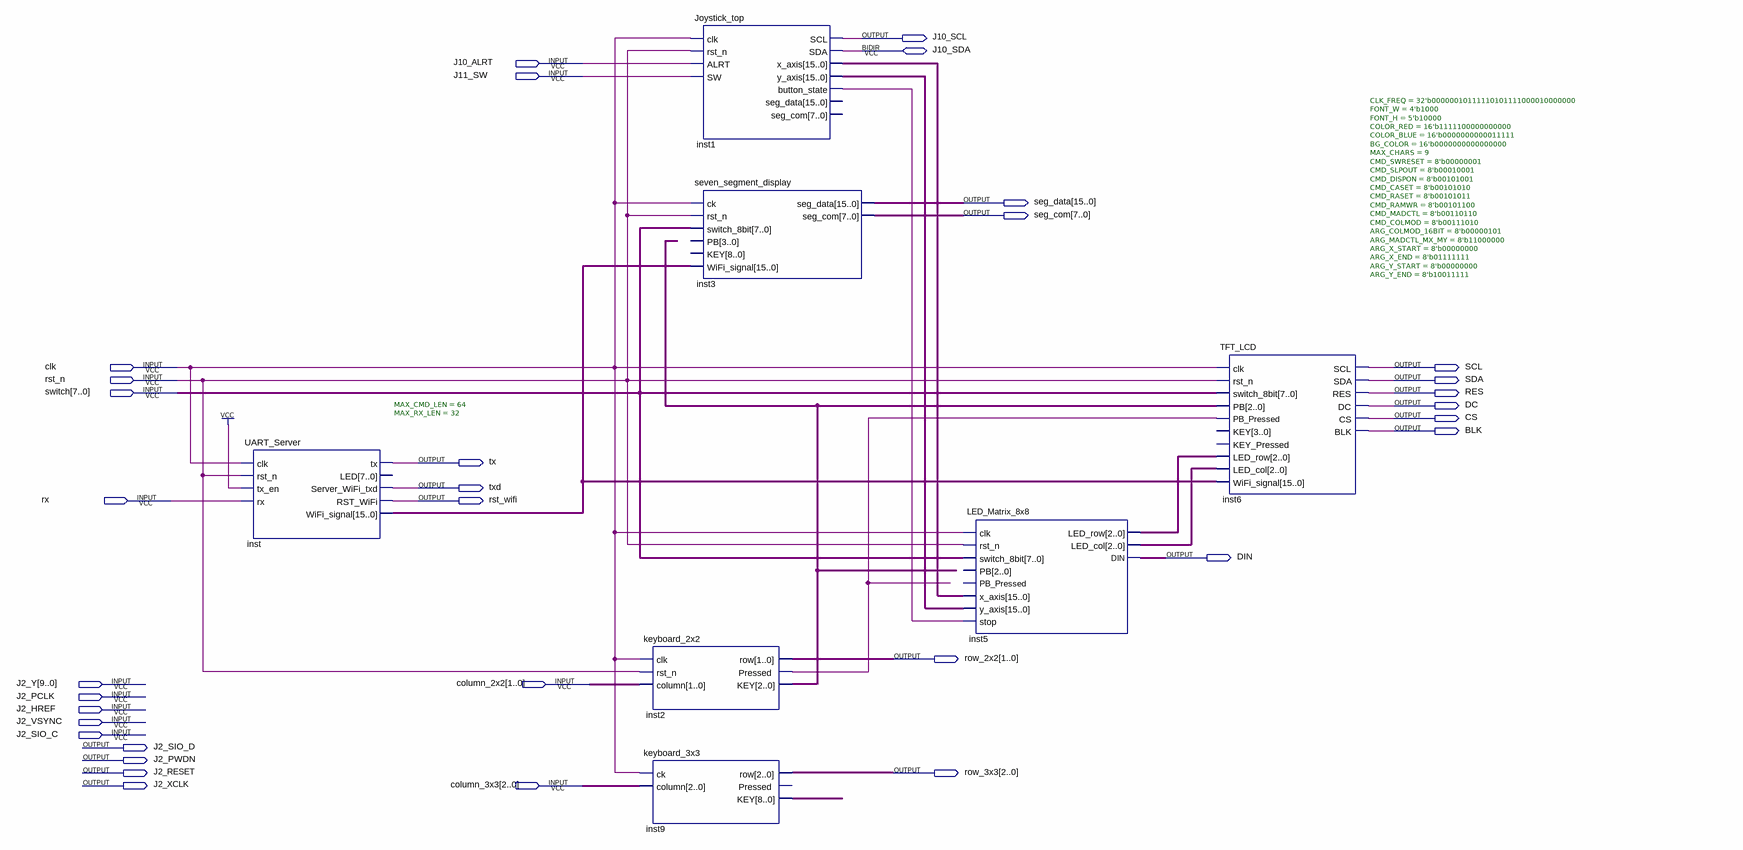
[diagram p0: schematic sheet]
// Quartus schematic top.bdf as structural Verilog: 7 symbols, 33 pins
module top (
  input  J10_ALRT,
  input  J11_SW,
  input  clk,
  input  rst_n,
  input  [7:0] switch,
  input  rx,
  input  [9:0] J2_Y,
  input  [1:0] column_2x2,
  input  J2_PCLK,
  input  J2_HREF,
  input  J2_VSYNC,
  input  J2_SIO_C,
  input  [2:0] column_3x3,
  inout  J10_SDA,
  output J10_SCL,
  output [15:0] seg_data,
  output [7:0] seg_com,
  output SCL,
  output SDA,
  output RES,
  output DC,
  output CS,
  output BLK,
  output tx,
  output txd,
  output rst_wifi,
  output DIN,
  output [1:0] row_2x2,
  output J2_SIO_D,
  output J2_PWDN,
  output J2_RESET,
  output [2:0] row_3x3,
  output J2_XCLK
);

  wire inst1_button_state, inst2_pressed;
  wire [2:0] inst2_key, inst5_led_col, inst5_led_row;
  wire [8:0] inst9_key;
  wire [15:0] inst1_x_axis, inst1_y_axis, inst_wifi_signal;

  UART_Server #(.MAX_CMD_LEN(64), .MAX_RX_LEN(32)) inst (
    .clk(clk), .rst_n(rst_n), .tx_en(1'b1), .rx(rx), .tx(tx), .Server_WiFi_txd(txd), .RST_WiFi(rst_wifi),
    .WiFi_signal(inst_wifi_signal));  // open: LED
  keyboard_2x2 inst2 (
    .clk(clk), .rst_n(rst_n), .column(column_2x2), .row(row_2x2), .Pressed(inst2_pressed), .KEY(inst2_key));
  keyboard_3x3 inst9 (.ck(clk), .column(column_3x3), .row(row_3x3), .KEY(inst9_key));  // open: Pressed
  Joystick_top inst1 (
    .clk(clk), .rst_n(rst_n), .ALRT(J10_ALRT), .SW(J11_SW), .SCL(J10_SCL), .x_axis(inst1_x_axis),
    .y_axis(inst1_y_axis), .button_state(inst1_button_state), .SDA(J10_SDA));  // open: seg_data, seg_com
  seven_segment_display inst3 (
    .ck(clk), .rst_n(rst_n), .switch_8bit(switch), .WiFi_signal(inst_wifi_signal), .seg_data(seg_data),
    .seg_com(seg_com));  // open: PB, KEY
  LED_Matrix_8x8 inst5 (
    .clk(clk), .rst_n(rst_n), .switch_8bit(switch), .x_axis(inst1_x_axis), .y_axis(inst1_y_axis),
    .stop(inst1_button_state), .LED_row(inst5_led_row), .LED_col(inst5_led_col), .DIN(DIN));  // open: PB, PB_Pressed
  TFT_LCD #(.CLK_FREQ(32'b00000010111110101111000010000000), .FONT_W(4'b1000), .FONT_H(5'b10000), .COLOR_RED(16'b1111100000000000), .COLOR_BLUE(16'b0000000000011111), .BG_COLOR(16'b0000000000000000), .MAX_CHARS(9), .CMD_SWRESET(8'b00000001), .CMD_SLPOUT(8'b00010001), .CMD_DISPON(8'b00101001), .CMD_CASET(8'b00101010), .CMD_RASET(8'b00101011), .CMD_RAMWR(8'b00101100), .CMD_MADCTL(8'b00110110), .CMD_COLMOD(8'b00111010), .ARG_COLMOD_16BIT(8'b00000101), .ARG_MADCTL_MX_MY(8'b11000000), .ARG_X_START(8'b00000000), .ARG_X_END(8'b01111111), .ARG_Y_START(8'b00000000), .ARG_Y_END(8'b10011111)) inst6 (
    .clk(clk), .rst_n(rst_n), .switch_8bit(switch), .PB(inst2_key), .PB_Pressed(inst2_pressed),
    .LED_row(inst5_led_row), .LED_col(inst5_led_col), .WiFi_signal(inst_wifi_signal), .SCL(SCL), .SDA(SDA),
    .RES(RES), .DC(DC), .CS(CS), .BLK(BLK));  // open: KEY, KEY_Pressed
endmodule
